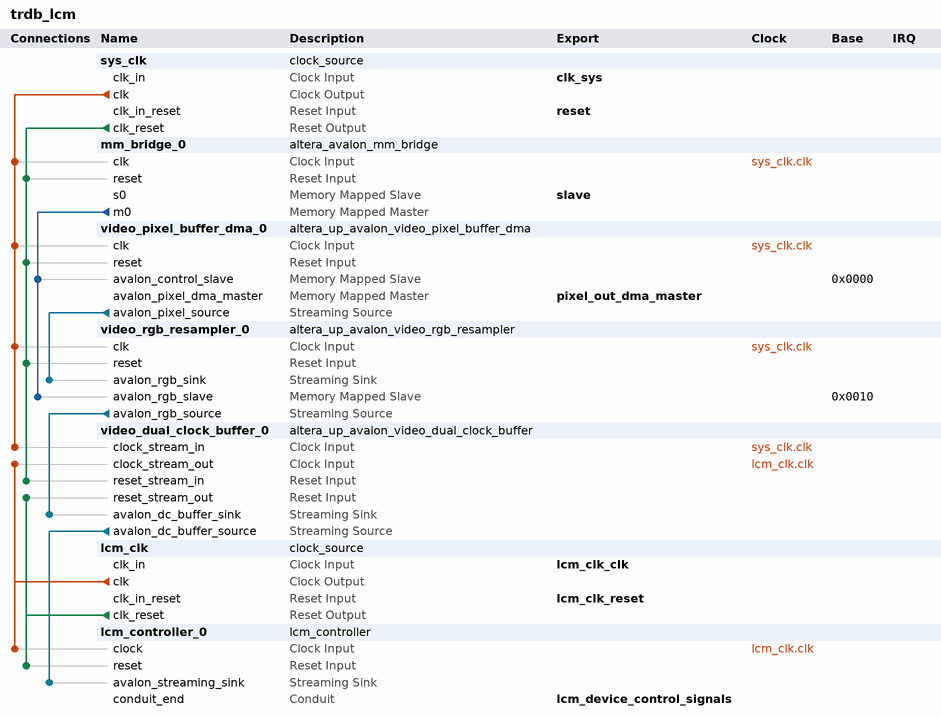
[diagram p0: system contents]
# Platform Designer (Qsys) system trdb_lcm, Cyclone V 5CSEMA5F31C6
# Parameters at their usual value, and those the tool derives, are not listed.
package require -exact qsys 20.1
create_system trdb_lcm
set_project_property DEVICE_FAMILY {Cyclone V}
set_project_property DEVICE 5CSEMA5F31C6

add_instance sys_clk clock_source 20.1
set_instance_parameter_value sys_clk clockFrequency 50000000

add_instance mm_bridge_0 altera_avalon_mm_bridge 20.1
set_instance_parameter_value mm_bridge_0 ADDRESS_UNITS SYMBOLS
set_instance_parameter_value mm_bridge_0 ADDRESS_WIDTH 10
set_instance_parameter_value mm_bridge_0 DATA_WIDTH 32
set_instance_parameter_value mm_bridge_0 MAX_PENDING_RESPONSES 4
set_instance_parameter_value mm_bridge_0 USE_AUTO_ADDRESS_WIDTH 1

add_instance video_pixel_buffer_dma_0 altera_up_avalon_video_pixel_buffer_dma 18.0
set_instance_parameter_value video_pixel_buffer_dma_0 addr_mode Consecutive
set_instance_parameter_value video_pixel_buffer_dma_0 back_start_address 0
set_instance_parameter_value video_pixel_buffer_dma_0 color_space {32-bit RGBA}
set_instance_parameter_value video_pixel_buffer_dma_0 image_height 240
set_instance_parameter_value video_pixel_buffer_dma_0 image_width 320
set_instance_parameter_value video_pixel_buffer_dma_0 start_address 0

add_instance video_rgb_resampler_0 altera_up_avalon_video_rgb_resampler 18.0
set_instance_parameter_value video_rgb_resampler_0 alpha 1023
set_instance_parameter_value video_rgb_resampler_0 input_type {32-bit RGBA}
set_instance_parameter_value video_rgb_resampler_0 output_type {24-bit RGB}

add_instance video_dual_clock_buffer_0 altera_up_avalon_video_dual_clock_buffer 18.0
set_instance_parameter_value video_dual_clock_buffer_0 color_bits 8

add_instance lcm_clk clock_source 20.1
set_instance_parameter_value lcm_clk clockFrequency 18420000

add_instance lcm_controller_0 lcm_controller 1.0

# connections
add_connection lcm_clk.clk lcm_controller_0.clock clock
add_connection lcm_clk.clk video_dual_clock_buffer_0.clock_stream_out clock
add_connection sys_clk.clk mm_bridge_0.clk clock
add_connection sys_clk.clk video_dual_clock_buffer_0.clock_stream_in clock
add_connection sys_clk.clk video_pixel_buffer_dma_0.clk clock
add_connection sys_clk.clk video_rgb_resampler_0.clk clock
add_connection lcm_clk.clk_reset lcm_controller_0.reset reset
add_connection lcm_clk.clk_reset video_dual_clock_buffer_0.reset_stream_out reset
add_connection sys_clk.clk_reset mm_bridge_0.reset reset
add_connection sys_clk.clk_reset video_dual_clock_buffer_0.reset_stream_in reset
add_connection sys_clk.clk_reset video_pixel_buffer_dma_0.reset reset
add_connection sys_clk.clk_reset video_rgb_resampler_0.reset reset
add_connection mm_bridge_0.m0 video_pixel_buffer_dma_0.avalon_control_slave avalon
set_connection_parameter_value mm_bridge_0.m0/video_pixel_buffer_dma_0.avalon_control_slave baseAddress 0x0000
add_connection mm_bridge_0.m0 video_rgb_resampler_0.avalon_rgb_slave avalon
set_connection_parameter_value mm_bridge_0.m0/video_rgb_resampler_0.avalon_rgb_slave baseAddress 0x0010
add_connection video_dual_clock_buffer_0.avalon_dc_buffer_source lcm_controller_0.avalon_streaming_sink avalon_streaming
add_connection video_pixel_buffer_dma_0.avalon_pixel_source video_rgb_resampler_0.avalon_rgb_sink avalon_streaming
add_connection video_rgb_resampler_0.avalon_rgb_source video_dual_clock_buffer_0.avalon_dc_buffer_sink avalon_streaming

# exported interfaces
add_interface clk_sys clock sink
set_interface_property clk_sys EXPORT_OF sys_clk.clk_in
add_interface lcm_clk_clk clock sink
set_interface_property lcm_clk_clk EXPORT_OF lcm_clk.clk_in
add_interface lcm_clk_reset reset sink
set_interface_property lcm_clk_reset EXPORT_OF lcm_clk.clk_in_reset
add_interface lcm_device_control_signals conduit end
set_interface_property lcm_device_control_signals EXPORT_OF lcm_controller_0.conduit_end
add_interface pixel_out_dma_master avalon master
set_interface_property pixel_out_dma_master EXPORT_OF video_pixel_buffer_dma_0.avalon_pixel_dma_master
add_interface reset reset sink
set_interface_property reset EXPORT_OF sys_clk.clk_in_reset
add_interface slave avalon slave
set_interface_property slave EXPORT_OF mm_bridge_0.s0

set_interconnect_requirement {$system} qsys_mm.clockCrossingAdapter HANDSHAKE
set_interconnect_requirement {$system} qsys_mm.enableEccProtection FALSE
set_interconnect_requirement {$system} qsys_mm.insertDefaultSlave FALSE
set_interconnect_requirement {$system} qsys_mm.maxAdditionalLatency 1

save_system trdb_lcm.qsys
